# EAGLE schematic uv-dosimeter-featherwing-mk-3.0 (EAGLE 7.5.0)
AUTHOR: sean@yak.net
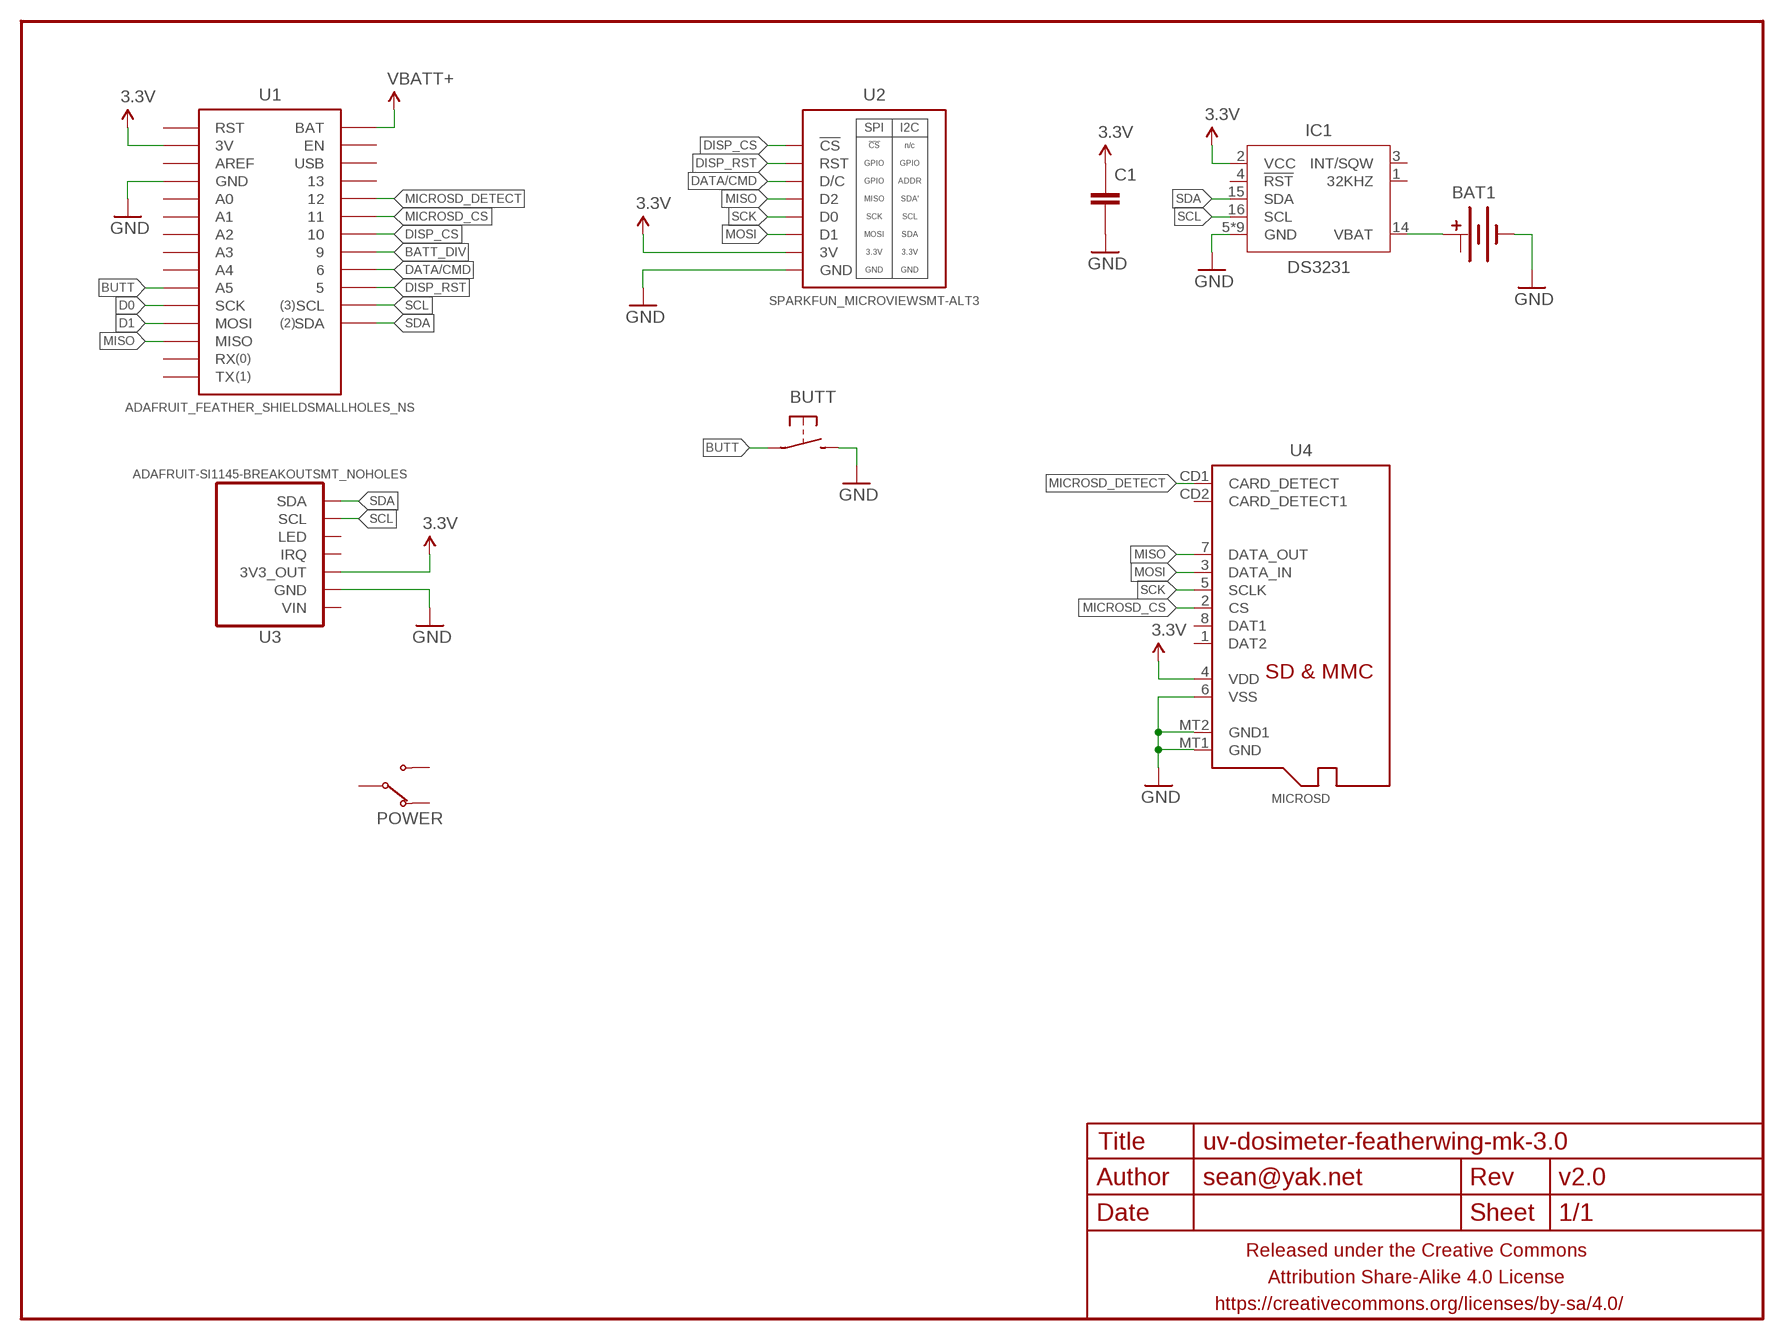
[diagram p0: schematic, sheet 1]

## Parts
BAT1  BATTERY-COINCR1225_SMD_SMALLER  [BATTCON_12MM_SMD]
BUTT  SPST-NO-TACT3MM-SMD  [DTSM-3]
C1  CAPACITOR-CERAMICC0603  [C0603]
FRAME1  FRAME-LETTERNO_PACKAGE  [DUMMY]
IC1  DS3231  [SO16W]
POWER  SWITCH-SPDTSMD-RA  [SWITCH-SPDT-SMD-RA]
U1  ADAFRUIT_FEATHER_SHIELDSMALLHOLES_NS  [ADAFRUIT_FEATHER_SMALLHOLES_NS]
U2  SPARKFUN_MICROVIEWSMT-ALT3  [SPARKFUN-MICROVIEW-SMT-ALT3]
U3  ADAFRUIT-SI1145-BREAKOUTSMT_NOHOLES  [ADAFRUIT-SI1145-BREAKOUT-SMT-NOHOLES]
U4  MICROSD  [MICROSD]

## Nets
3.3V: C1.1 IC1.2(VCC) U1.3V U2.3V U3.3V3(3V3_OUT)
BATT_DIV: U1.9
BUTT: BUTT.1 U1.A5
D0: U1.SCK
D1: U1.MOSI
DATA/CMD: U1.6 U2.D/C
DISP_CS: U1.10 U2.CS(!CS)
DISP_RST: U1.5 U2.RST
GND: BAT1.- BUTT.2 C1.2 IC1.5(GND) IC1.6(GND) IC1.7(GND) IC1.8(GND) IC1.9(GND) IC1.10(GND) IC1.11(GND) IC1.12(GND) IC1.13(GND) U1.GND@0(GND) U1.GND@1(GND) U2.GND U3.GND U4.6(VSS) U4.MT1(GND)
MICROSD_CS: U1.11 U4.2(CS)
MICROSD_DETECT: U1.12 U4.CD1(CARD_DETECT)
MISO: U1.MISO U2.D2 U4.7(DATA_OUT)
MOSI: U2.D1 U4.3(DATA_IN)
N$2: BAT1.+@1(+) IC1.14(VBAT)
SCK: U2.D0 U4.5(SCLK)
SCL: IC1.16(SCL) U1.SCL U3.SCL
SDA: IC1.15(SDA) U1.SDA U3.SDA
VBATT+: U1.BAT
VDD: U4.4(VDD) ; supply symbol labelled 3.3V
Unconnected: BAT1.+@2(+1) IC1.1(32KHZ) IC1.3(INT/SQW) IC1.4(!RST) POWER.1(NO) POWER.2(COM) POWER.3(NC) U1.13 U1.A0 U1.A1 U1.A2 U1.A3 U1.A4 U1.AREF U1.EN U1.RST U1.RX U1.TX U1.USB U3.IRQ U3.LED U3.VIN U4.1(DAT2) U4.8(DAT1) U4.CD2(CARD_DETECT1) U4.MT2(GND1)

## Library data of the parts
BAT1 = a_parts:BATTERY-COIN
BUTT = a_parts:SPST-NO-TACT
C1 = a_parts:CAPACITOR-CERAMIC: CAPACITOR, European symbol
FRAME1 = A_butts:FRAME-LETTER: Schematic Frame Standard 8.5x11 US Letter frame; DESIGNER: sean@yak.net; VERSION: v2.0
IC1 = a_parts:DS3231
POWER = a_parts:SWITCH-SPDT
U1 = a_parts:ADAFRUIT_FEATHER_SHIELD
U2 = a_parts:SPARKFUN_MICROVIEW
U3 = a_parts:ADAFRUIT-SI1145-BREAKOUT
U4 = a_parts:MICROSD: Micro-SD / Transflash card holder with SPI pinout For the 3M # 2908-05WB-MG and/or 4UCON #19656 push-push type